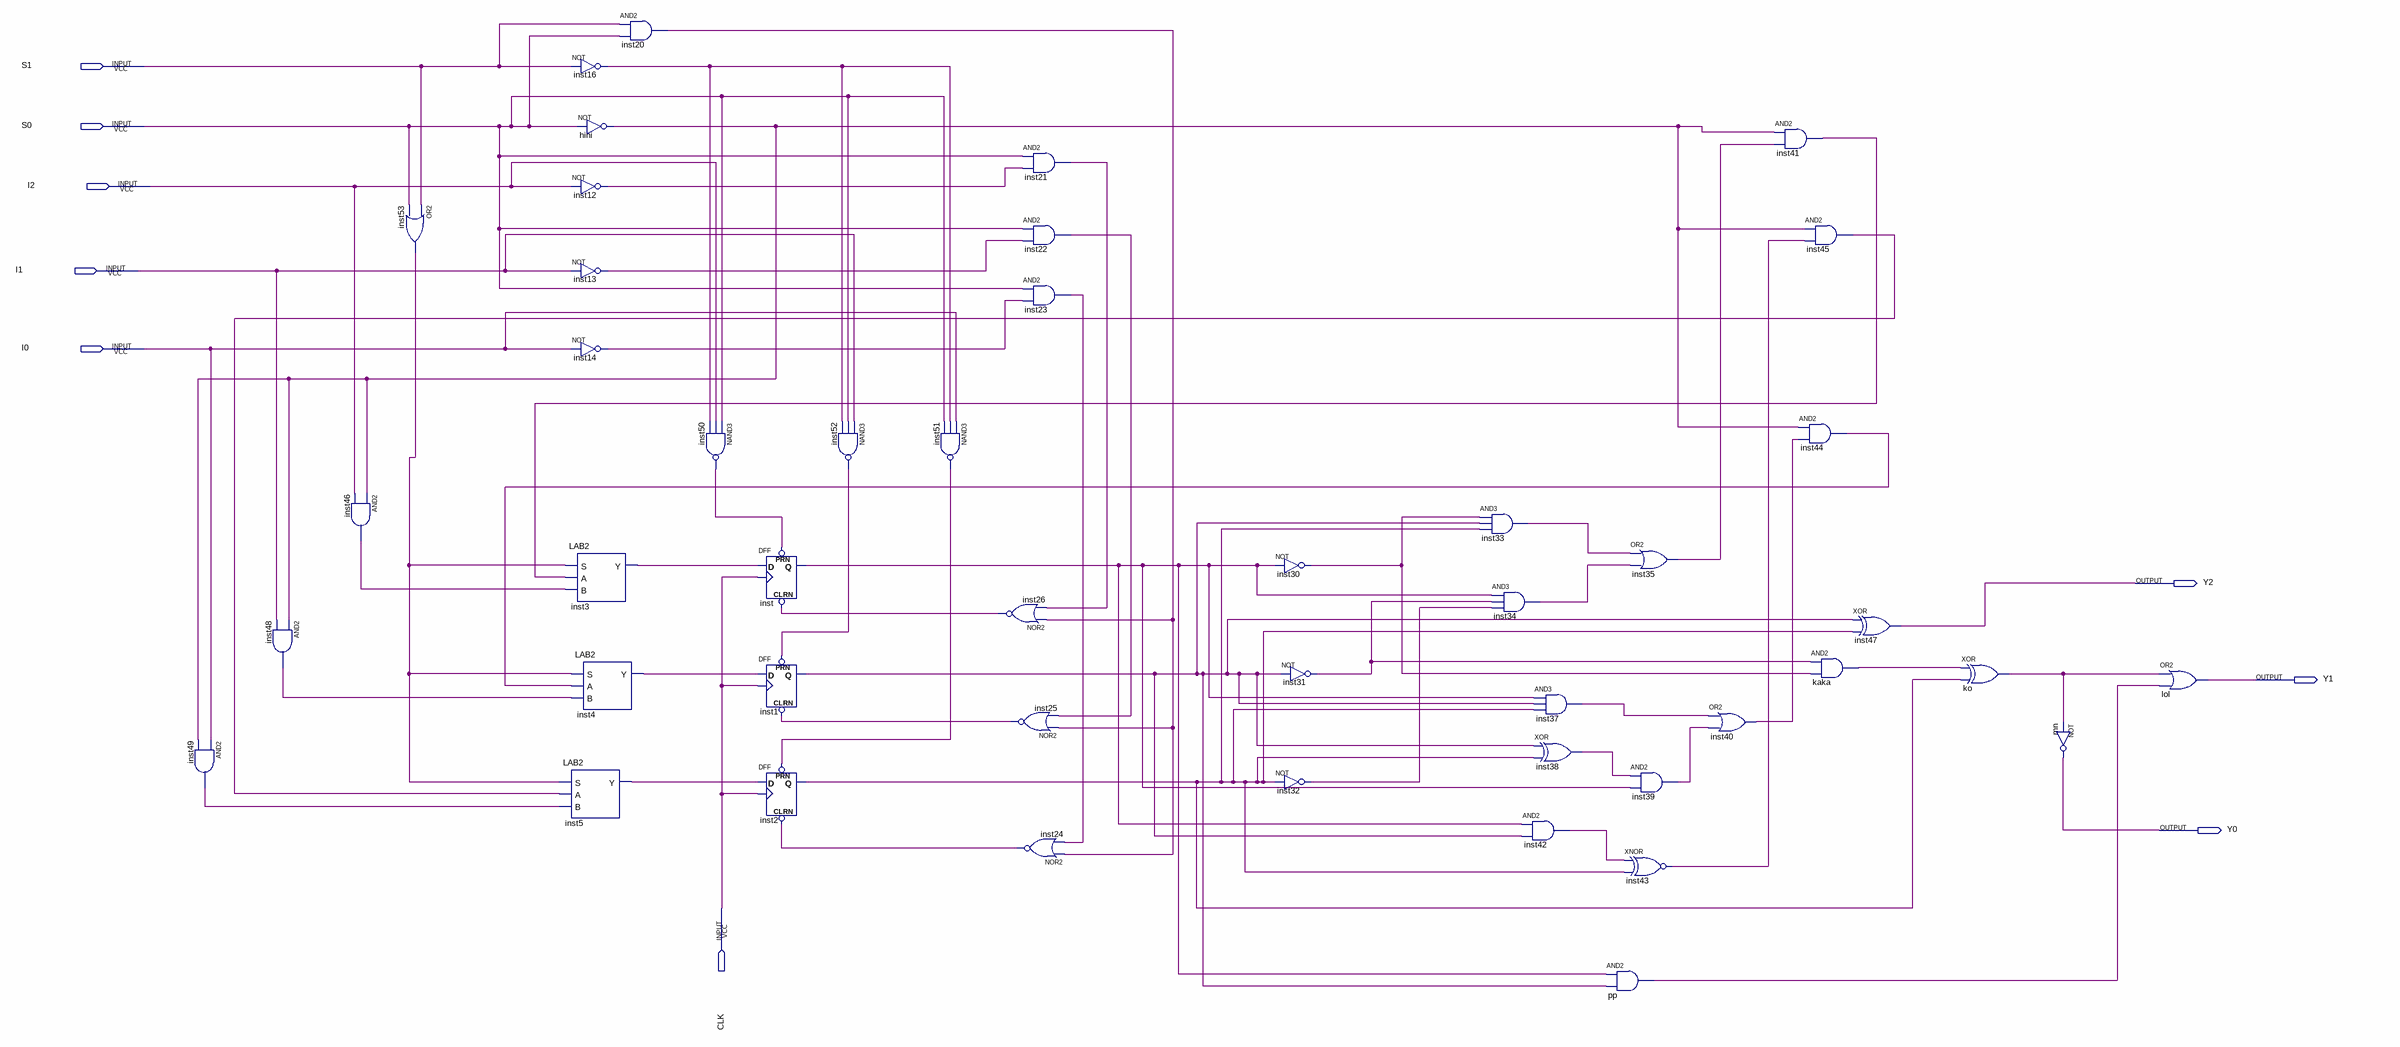
[diagram p0: schematic sheet]
// Quartus schematic lab1_haha.bdf as structural Verilog: 46 symbols, 9 pins
module lab1_haha (
  input  S1,
  input  S0,
  input  I2,
  input  I1,
  input  I0,
  input  CLK,
  output Y2,
  output Y1,
  output Y0
);

  wire hihi_out, inst1_q, inst2_q, inst3_y, inst4_y, inst5_y, inst12_out, inst13_out, inst14_out, inst16_out,
       inst20_out, inst21_out, inst22_out, inst23_out, inst24_out, inst25_out, inst26_out, inst30_out,
       inst31_out, inst32_out, inst33_out, inst34_out, inst35_out, inst37_out, inst38_out, inst39_out,
       inst40_out, inst41_out, inst42_out, inst43_out, inst44_out, inst45_out, inst46_out, inst48_out,
       inst49_out, inst50_out, inst51_out, inst52_out, inst53_out, inst_q, kaka_out, ko_out, pp_out;

  and inst49 (inst49_out, I0, hihi_out);
  and inst48 (inst48_out, hihi_out, I1);
  and inst46 (inst46_out, hihi_out, I2);
  or inst53 (inst53_out, S1, S0);
  LAB2 inst5 (.S(inst53_out), .A(inst45_out), .B(inst49_out), .Y(inst5_y));
  not inst16 (inst16_out, S1);
  not hihi (hihi_out, S0);
  not inst12 (inst12_out, I2);
  not inst13 (inst13_out, I1);
  not inst14 (inst14_out, I0);
  LAB2 inst3 (.S(inst53_out), .A(inst41_out), .B(inst46_out), .Y(inst3_y));
  LAB2 inst4 (.S(inst53_out), .A(inst44_out), .B(inst48_out), .Y(inst4_y));
  and inst20 (inst20_out, S1, S0);
  nand inst50 (inst50_out, S0, I2, inst16_out);
  DFF inst (.CLRN(inst26_out), .CLK(CLK), .D(inst3_y), .PRN(inst50_out), .Q(inst_q));
  DFF inst1 (.CLRN(inst25_out), .CLK(CLK), .D(inst4_y), .PRN(inst52_out), .Q(inst1_q));
  DFF inst2 (.CLRN(inst24_out), .CLK(CLK), .D(inst5_y), .PRN(inst51_out), .Q(inst2_q));
  nand inst52 (inst52_out, I1, S0, inst16_out);
  nand inst51 (inst51_out, I0, inst16_out, S0);
  and inst21 (inst21_out, S0, inst12_out);
  and inst22 (inst22_out, S0, inst13_out);
  and inst23 (inst23_out, S0, inst14_out);
  nor inst26 (inst26_out, inst20_out, inst21_out);
  nor inst25 (inst25_out, inst20_out, inst22_out);
  nor inst24 (inst24_out, inst20_out, inst23_out);
  not inst30 (inst30_out, inst_q);
  not inst31 (inst31_out, inst1_q);
  not inst32 (inst32_out, inst2_q);
  and inst33 (inst33_out, inst30_out, inst1_q, inst2_q);
  and inst34 (inst34_out, inst_q, inst31_out, inst32_out);
  and inst42 (inst42_out, inst_q, inst1_q);
  and inst37 (inst37_out, inst_q, inst1_q, inst2_q);
  xor inst38 (inst38_out, inst1_q, inst2_q);
  and pp (pp_out, inst_q, inst1_q);
  or inst35 (inst35_out, inst33_out, inst34_out);
  and inst39 (inst39_out, inst38_out, inst_q);
  xnor inst43 (inst43_out, inst42_out, inst2_q);
  or inst40 (inst40_out, inst37_out, inst39_out);
  and inst41 (inst41_out, hihi_out, inst35_out);
  and inst45 (inst45_out, hihi_out, inst43_out);
  and inst44 (inst44_out, hihi_out, inst40_out);
  and kaka (kaka_out, inst31_out, inst30_out);
  xor inst47 (Y2, inst1_q, inst2_q);
  xor ko (ko_out, kaka_out, inst2_q);
  not mn (Y0, ko_out);
  or lol (Y1, ko_out, pp_out);
endmodule
